# Altium schematic sheet Microcontroller.SchDoc
size A4; SheetNumber: 4; SheetTotal: 9
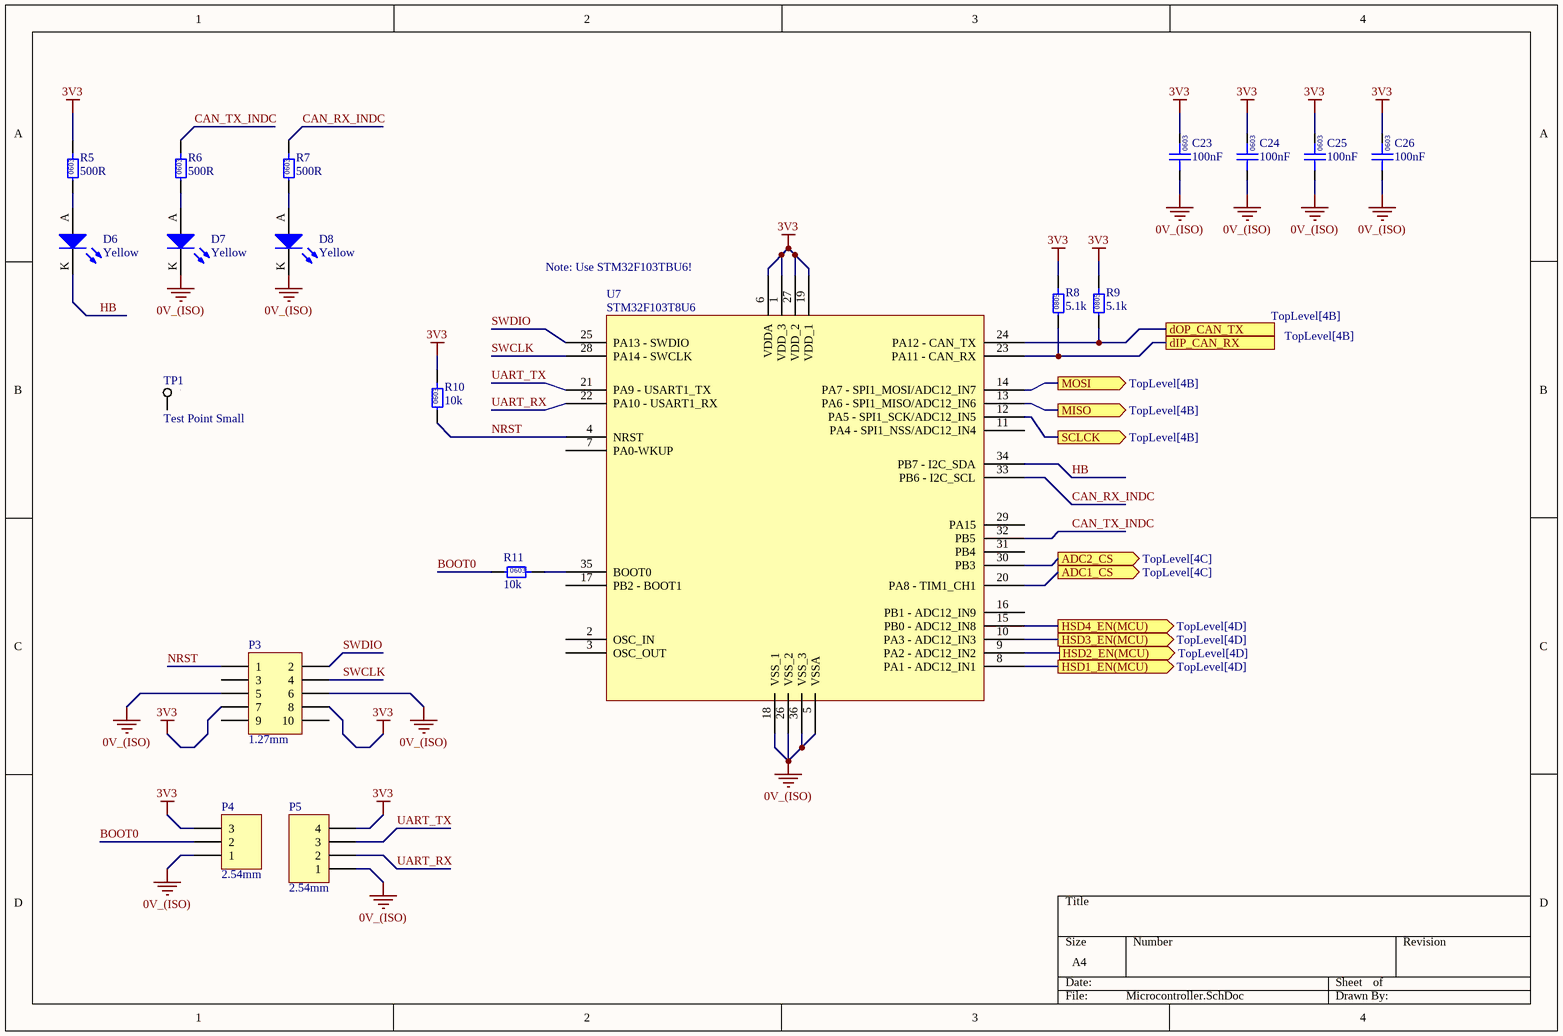
[diagram p0: Microcontroller.SchDoc]

## Parts
C23  100nF  [0603]
C24  100nF  [0603]
C25  100nF  [0603]
C26  100nF  [0603]
D6  Yellow  [0805 LED]
D7  Yellow  [0805 LED]
D8  Yellow  [0805 LED]
P3  1.27mm  [3221-10-0300-00]
P4  2.54mm  [TH 2.54mm Header 1x3]
P5  2.54mm  [TH 2.54mm Header 1x4]
R5  500R  [0603]
R6  500R  [0603]
R7  500R  [0603]
R8  5.1k  [0805]
R9  5.1k  [0805]
R10  10k  [0603]
R11  10k  [0603]
TP1  Test Point Small  [SMD Test Point 1mm]
U7  STM32F103T8U6  [STM_QFN-36]

## Ports
ADC1_CS (out, see TopLevel[4C]), ADC2_CS (out, see TopLevel[4C]), dIP_CAN_RX (see TopLevel[4B]), dOP_CAN_TX (see TopLevel[4B]), HSD1_EN(MCU) (out, see TopLevel[4D]), HSD2_EN(MCU) (out, see TopLevel[4D]), HSD3_EN(MCU) (out, see TopLevel[4D]), HSD4_EN(MCU) (out, see TopLevel[4D]), MISO (out, see TopLevel[4B]), MOSI (out, see TopLevel[4B]), SCLCK (out, see TopLevel[4B])

## Nets
0V_(ISO): C23.1 C24.1 C25.1 C26.1 D7.K D8.K P3.5 P3.6 P4.1 P5.1 U7.5(VSSA) U7.18(VSS_1) U7.26(VSS_2) U7.36(VSS_3)
3V3: C23.2 C24.2 C25.2 C26.2 P3.7 P3.8 P4.3 P5.4 R5.2 R8.2 R9.2 R10.2 U7.1(VDD_3) U7.6(VDDA) U7.19(VDD_1) U7.27(VDD_2)
ADC1_CS: U7.20(PA8_-_TIM1_CH1) ; port ADC1_CS
ADC2_CS: U7.30(PB3) ; port ADC2_CS
BOOT0: P4.2 R11.1
CAN_RX_INDC: R7.2 U7.33(PB6_-_I2C_SCL)
CAN_TX_INDC: R6.2 U7.32(PB5)
dIP_CAN_RX: R8.1 U7.23(PA11_-_CAN_RX) ; port dIP_CAN_RX
dOP_CAN_TX: R9.1 U7.24(PA12_-_CAN_TX) ; port dOP_CAN_TX
HB: D6.K U7.34(PB7_-_I2C_SDA)
HSD1_EN(MCU): U7.8(PA1_-_ADC12_IN1) ; port HSD1_EN(MCU)
HSD2_EN(MCU): U7.9(PA2_-_ADC12_IN2) ; port HSD2_EN(MCU)
HSD3_EN(MCU): U7.10(PA3_-_ADC12_IN3) ; port HSD3_EN(MCU)
HSD4_EN(MCU): U7.15(PB0_-_ADC12_IN8) ; port HSD4_EN(MCU)
MISO: U7.13(PA6_-_SPI1_MISO/ADC12_IN6) ; port MISO
MOSI: U7.14(PA7_-_SPI1_MOSI/ADC12_IN7) ; port MOSI
NRST: P3.1 R10.1 U7.4(NRST)
SCLCK: U7.12(PA5_-_SPI1_SCK/ADC12_IN5) ; port SCLCK
SWCLK: P3.4 U7.28(PA14_-_SWCLK)
SWDIO: P3.2 U7.25(PA13_-_SWDIO)
UART_RX: P5.2 U7.22(PA10_-_USART1_RX)
UART_TX: P5.3 U7.21(PA9_-_USART1_TX)
NetD6_A: D6.A R5.1
NetD7_A: D7.A R6.1
NetD8_A: D8.A R7.1
NetR11_2: R11.2 U7.35(BOOT0)

Not connected (* = marked no-connect by the designer): P3 3 9 10; TP1 1; U7 2(OSC_IN) 3(OSC_OUT) 7(PA0-WKUP) 11(PA4_-_SPI1_NSS/ADC12_IN4) 16(PB1_-_ADC12_IN9) 17(PB2_-_BOOT1_) 29(PA15) 31(PB4)

## Notes on the sheet
- (near U7) Note: Use STM32F103TBU6!
- (in symbol GCM188L81H104KA57D) 0603
- (in symbol RC0603FR-0710KL) 0603
- (in symbol RC0805FR075K1L) 0805
- (in symbol RT0603BRD07500RL) 0603

## Library data of the parts
C23-C26 = GCM188L81H104KA57D: Manufacturer: muRata; Rated Voltage: 50V; Tolerance: ±10%; Material: MLCC; Temperature Rating: X8L; Part Number: GCM188L81H104KA57D; Value: 100nF; Digikey Part Number: 490-6049-1-ND
D6-D8 = SML-211YTT86: Yellow LED Indication - Discrete 1.75V 0805 (2012 Metric); Manufacturer: ROHM Semiconductor; Part Number: SML-211YTT86; Colour: Yellow; Digikey Part Number: 511-1293-1-ND
P3 = SMD 1.27mm Header 2x5 (3221-10-0300-00): Positions: 10; Angle: 0; Flange: No; Contact: NA; Part Number: SMD 1.27mm Header 2x5 (3221-10-0300-00); Pitch: 1.27mm; Row Spacing: 1.27mm
P4 = TH 2.54mm Header 1x3: Positions: 3; Angle: 0; Flange: No; Contact: NA; Part Number: TH 2.54mm Header 1x3; Pitch: 2.54mm; Row Spacing: 2.54mm
P5 = TH 2.54mm Header 1x4: Positions: 4; Angle: 0; Flange: No; Contact: NA; Part Number: TH 2.54mm Header 1x4; Pitch: 2.54mm; Row Spacing: 2.54mm
R5-R7 = RT0603BRD07500RL: Manufacturer: YAGEO; Tolerance: 0.01; Rated Power: 0.1W; Part Number: RT0603BRD07500RL; Value: 500R; Material: FR-07; Digikey Part Number: 13-RT0603BRD07500RL-ND
R8 R9 = RC0805FR075K1L: Manufacturer: YAGEO; Tolerance: 0.01; Rated Power: 0.125W; Part Number: RC0805FR075K1L; Value: 5.1k; Material: FR-07; Digikey Part Number: 311-5.10KCRCT-ND
R10 R11 = RC0603FR-0710KL: Manufacturer: YAGEO; Tolerance: 0.01; Rated Power: 0.1W; Part Number: RC0603FR-0710KL; Value: 10k; Digikey Part Number: 311-10.0KHRCT-ND; Material: FR-07
TP1 = SMD Test Point Small: Positions: 1; Pitch: 0mm; Row Spacing: 0; Flange: No; Contact: NA; Part Number: SMD Test Point Small; Angle: 0
U7 = STM32F103T8U6: ARM® Cortex®-M3 STM32F1 Microcontroller IC 32-Bit 72MHz 64KB (64K x 8) FLASH QFN; Manufacturer: ST Microelectronics; Part Number: STM32F103T8U6; Digikey Part Number: STM32F103T8U6; Digikey Link: https://www.digikey.com/en/products/detail/stmicroelectronics/stm32f103t8u6/1852493